# Altium project VCU_PIC32MK.PrjPcb
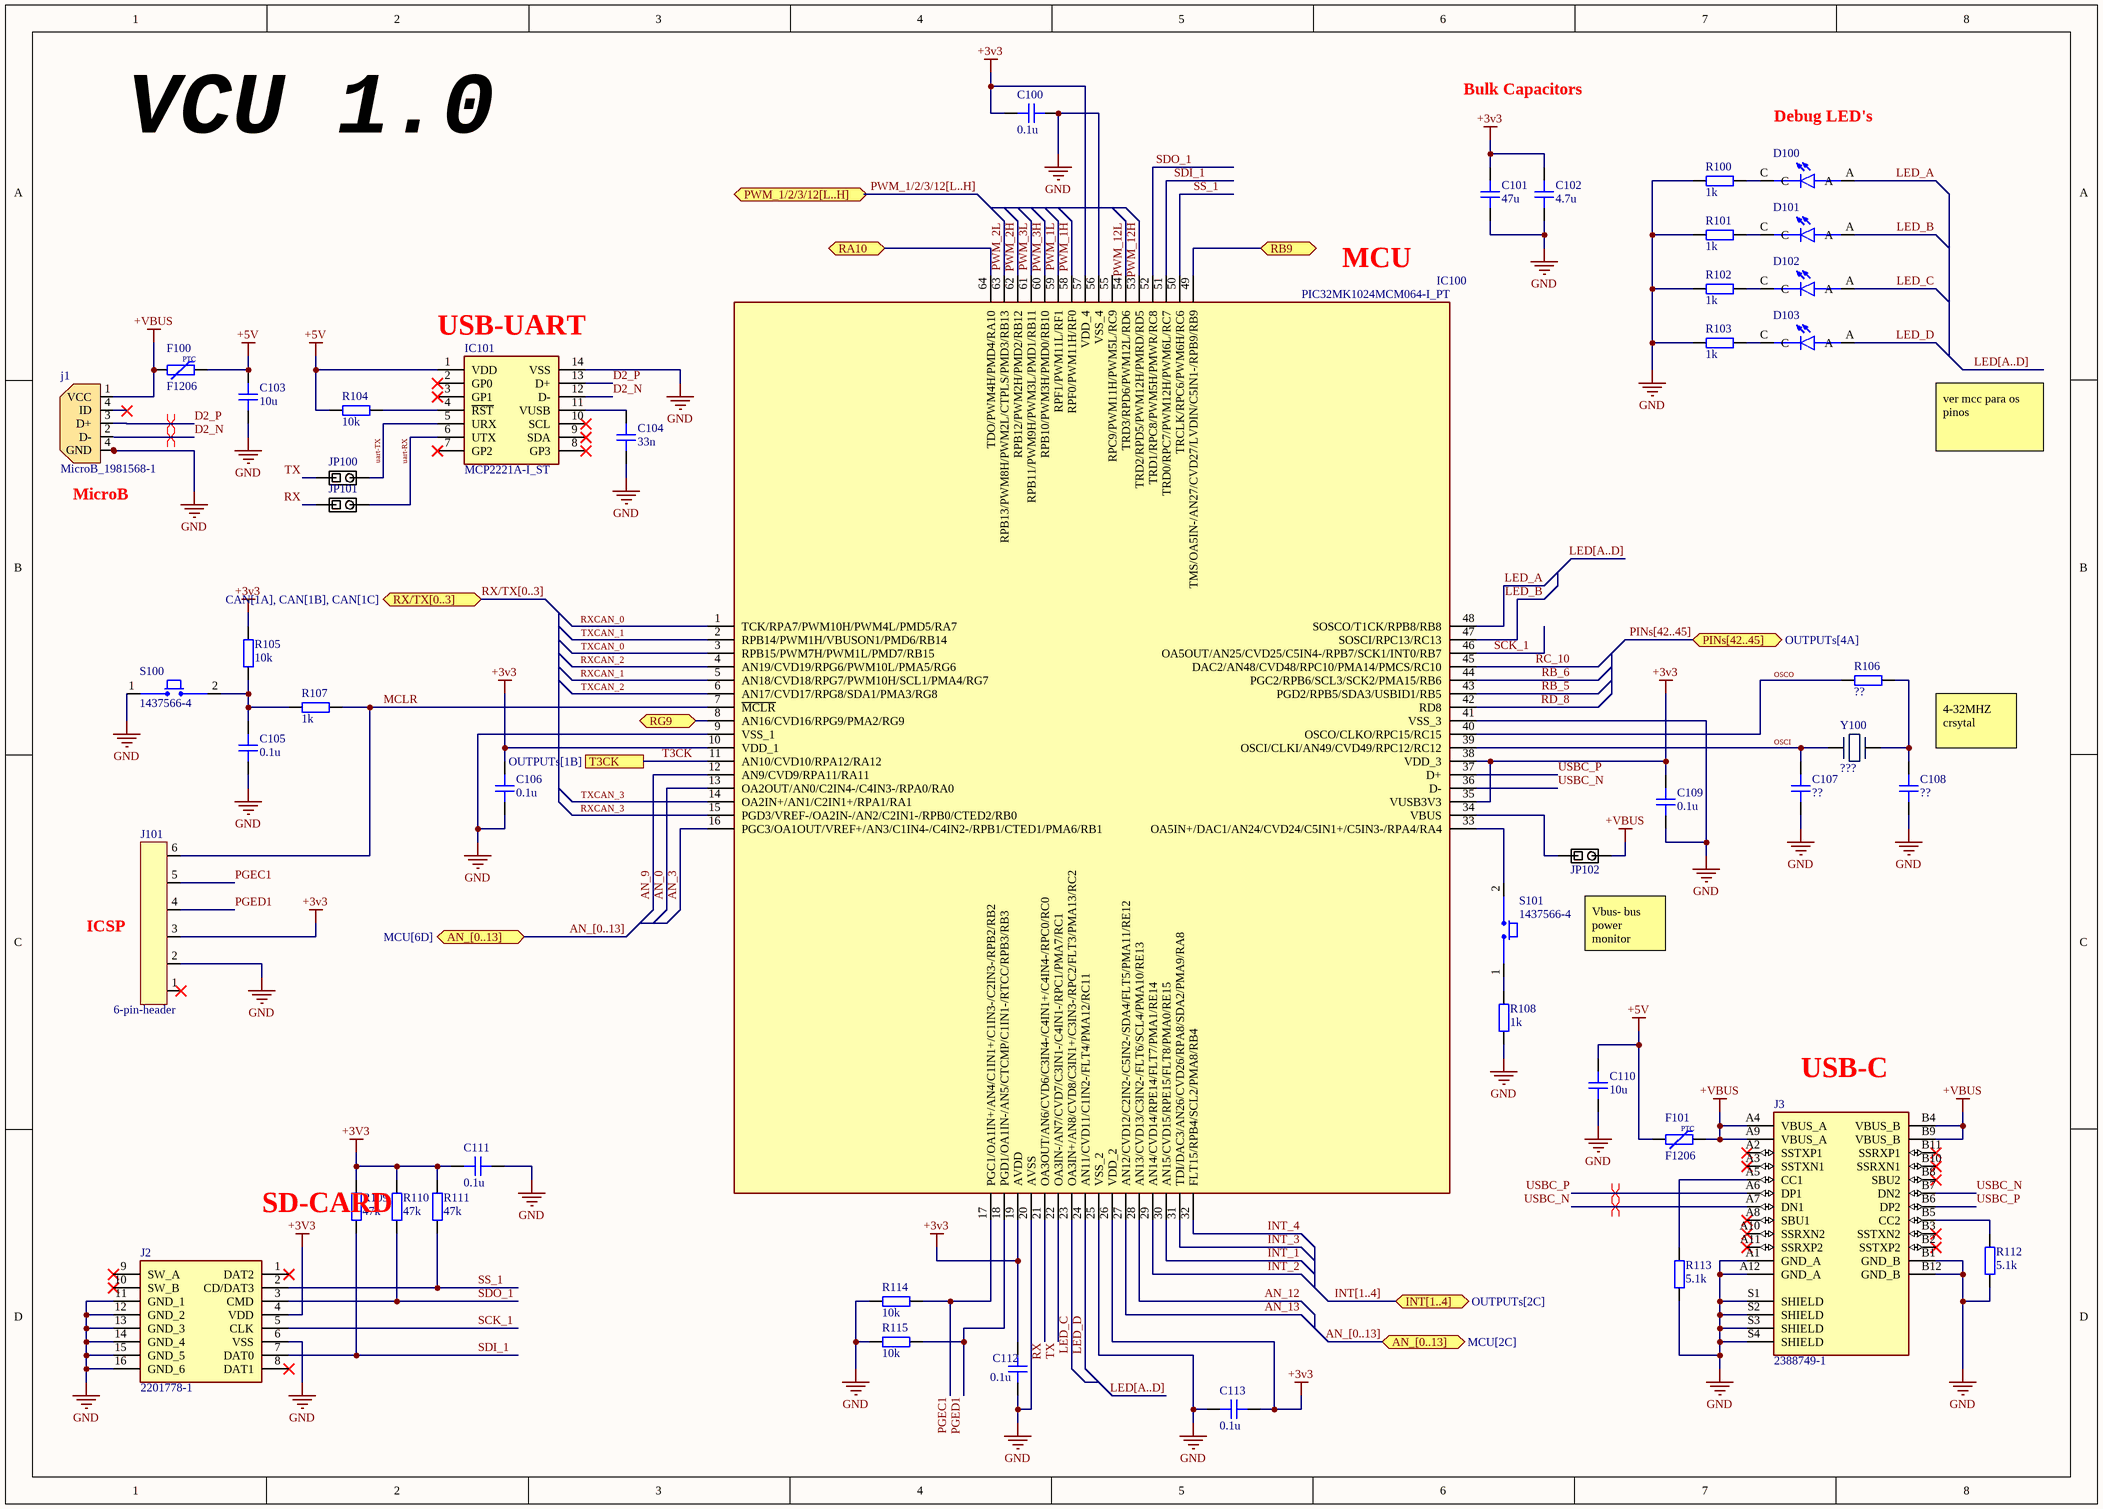
[diagram p0: MCU.SchDoc]
5 sheets, 135 parts. Net scope: global (net labels, ports and power ports of the same name join across sheets).
Board file: VCU_PCB.PcbDoc
Sheets:
  MCU.SchDoc
  POWER.SchDoc
  CAN.SchDoc
  OUTPUTs.SchDoc
  H_Bridge.SchDoc

## Sheet MCU.SchDoc
size A3; SheetNumber: 1; SheetTotal: 5

### Parts
C100  0.1u  [CAP_0805]
C101  47u  [CAP_0805]
C102  4.7u  [CAP_0805]
C103  10u  [CAP_0805]
C104  33n  [CAP_0805]
C105  0.1u  [CAP_0805]
C106  0.1u  [CAP_0805]
C107  ??  [CAP_0805]
C108  ??  [CAP_0805]
C109  0.1u  [CAP_0805]
C110  10u  [CAP_0805]
C111  0.1u  [CAP_0805]
C112  0.1u  [CAP_0805]
C113  0.1u  [CAP_0805]
D100  SML-LXT0805IW-TR  [LEDC2012X120N]  (value not drawn)
D101  SML-LXT0805IW-TR  [LEDC2012X120N]  (value not drawn)
D102  SML-LXT0805IW-TR  [LEDC2012X120N]  (value not drawn)
D103  SML-LXT0805IW-TR  [LEDC2012X120N]  (value not drawn)
F100  F1206  [FUSE_1206]
F101  F1206  [FUSE_1206]
IC100  PIC32MK1024MCM064-I_PT  [QFP50P1200X1200X120-64N]
IC101  MCP2221A-I_ST  [SOP65P640X120-14N]
j1  MicroB_1981568-1  [1981568-1]
J2  2201778-1  [22017781]
J3  2388749-1  [TE_2388749-1]
J101  6-pin-header  [G800W302018EU]
JP100  Solder Jumper  [SolderJumper_Single]  (value not drawn)
JP101  Solder Jumper  [SolderJumper_Single]  (value not drawn)
JP102  Solder Jumper  [SolderJumper_Single]  (value not drawn)
R100  1k  [RES_0805]
R101  1k  [RES_0805]
R102  1k  [RES_0805]
R103  1k  [RES_0805]
R104  10k  [RES_0805]
R105  10k  [RES_0805]
R106  ??  [RES_0805]
R107  1k  [RES_0805]
R108  1k  [RES_0805]
R109  47k  [RES_0805]
R110  47k  [RES_0805]
R111  47k  [RES_0805]
R112  5.1k  [RES_0805]
R113  5.1k  [RES_0805]
R114  10k  [RES_0805]
R115  10k  [RES_0805]
S100  1437566-4  [SW_1437566-4]
S101  1437566-4  [SW_1437566-4]
Y100  ???  [ABM38000MHZC4T]

### Ports
AN_[0..13] (bidir, see MCU[2C]), AN_[0..13] (bidir, see MCU[6D]), INT[1..4] (bidir, see OUTPUTs[2C]), PINs[42..45] (bidir, see OUTPUTs[4A]), PWM_1/2/3/12[L..H] (bidir), RA10 (bidir, see OUTPUTs[1C]), RB9 (bidir, see OUTPUTs[1C]), RG9 (bidir, see OUTPUTs[1C]), RX/TX[0..3] (bidir, see CAN[1A], CAN[1B], CAN[1C]), T3CK (see OUTPUTs[1B])

### Nets
+3v3: C100.1 C101.1 C102.1 C106.2 C109.1 C111.2 C112.2 C113.1 IC100.10(VDD_1) IC100.19(AVDD) IC100.26(VDD_2) IC100.35(VUSB3V3) IC100.38(VDD_3) IC100.57(VDD_4) J2.4(VDD) J101.3 R105.2 R109.2 R110.2 R111.2
+5V: C103.1 C110.1 F100.2 F101.1 IC101.1(VDD) R104.2
+VBUS: F100.1 F101.2 j1.1(VCC) J3.A4(VBUS_A) J3.A9(VBUS_A) J3.B4(VBUS_B) J3.B9(VBUS_B) JP102.2
GND: C100.2 C101.2 C102.2 C103.2 C104.1 C105.1 C106.1 C107.1 C108.1 C109.2 C110.2 C111.1 C112.1 C113.2 IC100.9(VSS_1) IC100.20(AVSS) IC100.25(VSS_2) IC100.41(VSS_3) IC100.56(VSS_4) IC101.14(VSS) j1.4(GND) J2.6(VSS) J2.11(GND_1) J2.12(GND_2) J2.13(GND_3) J2.14(GND_4) J2.15(GND_5) J2.16(GND_6) J3.A1(GND_A) J3.A12(GND_A) J3.B1(GND_B) J3.B12(GND_B) J3.S1(SHIELD) J3.S2(SHIELD) J3.S3(SHIELD) J3.S4(SHIELD) J101.2 R100.1 R101.1 R102.1 R103.1 R108.1 R112.2 R113.2 R114.2 R115.1 S100.1
AN_0: IC100.13(OA2OUT/AN0/C2IN4-/C4IN3-/RPA0/RA0)
AN_3: IC100.16(PGC3/OA1OUT/VREF+/AN3/C1IN4-/C4IN2-/RPB1/CTED1/PMA6/RB1)
AN_9: IC100.12(AN9/CVD9/RPA11/RA11)
AN_12: IC100.28(AN13/CVD13/C3IN2-/FLT6/SCL4/PMA10/RE13)
AN_13: IC100.27(AN12/CVD12/C2IN2-/C5IN2-/SDA4/FLT5/PMA11/RE12)
D2_N: IC101.12(D-) j1.2(D-)
D2_P: IC101.13(D+) j1.3(D+)
INT_1: IC100.30(AN15/CVD15/RPE15/FLT8/PMA0/RE15)
INT_2: IC100.29(AN14/CVD14/RPE14/FLT7/PMA1/RE14)
INT_3: IC100.31(TDI/DAC3/AN26/CVD26/RPA8/SDA2/PMA9/RA8)
INT_4: IC100.32(FLT15/RPB4/SCL2/PMA8/RB4)
LED_A: D100.A IC100.48(SOSCO/T1CK/RPB8/RB8)
LED_B: D101.A IC100.47(SOSCI/RPC13/RC13)
LED_C: D102.A IC100.23(OA3IN+/AN8/CVD8/C3IN1+/C3IN3-/RPC2/FLT3/PMA13/RC2)
LED_D: D103.A IC100.24(AN11/CVD11/C1IN2-/FLT4/PMA12/RC11)
MCLR: IC100.7(~{MCLR}) J101.6 R107.2
OSCI: C107.2 IC100.39(OSCI/CLKI/AN49/CVD49/RPC12/RC12) Y100.1
OSCO: IC100.40(OSCO/CLKO/RPC15/RC15) R106.2
PGEC1: IC100.17(PGC1/OA1IN+/AN4/C1IN1+/C1IN3-/C2IN3-/RPB2/RB2) J101.5 R114.1
PGED1: IC100.18(PGD1/OA1IN-/AN5/CTCMP/C1IN1-/RTCC/RPB3/RB3) J101.4 R115.2
PWM_1H: IC100.58(RPF0/PWM11H/RF0)
PWM_1L: IC100.59(RPF1/PWM11L/RF1)
PWM_2H: IC100.62(RPB12/PWM2H/PMD2/RB12)
PWM_2L: IC100.63(RPB13/PWM8H/PWM2L/CTPLS/PMD3/RB13)
PWM_3H: IC100.60(RPB10/PWM3H/PMD0/RB10)
PWM_3L: IC100.61(RPB11/PWM9H/PWM3L/PMD1/RB11)
PWM_12H: IC100.53(TRD2/RPD5/PWM12H/PMRD/RD5)
PWM_12L: IC100.54(TRD3/RPD6/PWM12L/RD6)
RB_5: IC100.43(PGD2/RPB5/SDA3/USBID1/RB5)
RB_6: IC100.44(PGC2/RPB6/SCL3/SCK2/PMA15/RB6)
RC_10: IC100.45(DAC2/AN48/CVD48/RPC10/PMA14/PMCS/RC10)
RD_8: IC100.42(RD8)
RX: IC100.21(OA3OUT/AN6/CVD6/C3IN4-/C4IN1+/C4IN4-/RPC0/RC0) JP101.1
RXCAN_0: IC100.1(TCK/RPA7/PWM10H/PWM4L/PMD5/RA7)
RXCAN_1: IC100.5(AN18/CVD18/RPG7/PWM10H/SCL1/PMA4/RG7)
RXCAN_2: IC100.4(AN19/CVD19/RPG6/PWM10L/PMA5/RG6)
RXCAN_3: IC100.15(PGD3/VREF-/OA2IN-/AN2/C2IN1-/RPB0/CTED2/RB0)
SCK_1: IC100.46(OA5OUT/AN25/CVD25/C5IN4-/RPB7/SCK1/INT0/RB7) J2.5(CLK)
SDI_1: IC100.51(TRD0/RPC7/PWM12H/PWM6L/RC7) J2.7(DAT0) R109.1
SDO_1: IC100.52(TRD1/RPC8/PWM5H/PMWR/RC8) J2.3(CMD) R110.1
SS_1: IC100.50(TRCLK/RPC6/PWM6H/RC6) J2.2(CD/DAT3) R111.1
T3CK: IC100.11(AN10/CVD10/RPA12/RA12) ; port T3CK
TX: IC100.22(OA3IN-/AN7/CVD7/C3IN1-/C4IN1-/RPC1/PMA7/RC1) JP100.1
TXCAN_0: IC100.3(RPB15/PWM7H/PWM1L/PMD7/RB15)
TXCAN_1: IC100.2(RPB14/PWM1H/VBUSON1/PMD6/RB14)
TXCAN_2: IC100.6(AN17/CVD17/RPG8/SDA1/PMA3/RG8)
TXCAN_3: IC100.14(OA2IN+/AN1/C2IN1+/RPA1/RA1)
uart-RX: IC101.6(UTX) JP101.2
uart-TX: IC101.5(URX) JP100.2
USBC_N: IC100.36(D-) J3.A7(DN1) J3.B7(DN2)
USBC_P: IC100.37(D+) J3.A6(DP1) J3.B6(DP2)
NetC104_2: C104.2 IC101.11(VUSB)
NetC105_2: C105.2 R105.1 R107.1 S100.2
NetC108_2: C108.2 R106.1 Y100.2
NetD100_C: D100.C R100.2
NetD101_C: D101.C R101.2
NetD102_C: D102.C R102.2
NetD103_C: D103.C R103.2
NetIC100_8: IC100.8(AN16/CVD16/RPG9/PMA2/RG9) ; port RG9
NetIC100_33: IC100.33(OA5IN+/DAC1/AN24/CVD24/C5IN1+/C5IN3-/RPA4/RA4) S101.2
NetIC100_34: IC100.34(VBUS) JP102.1
NetIC100_49: IC100.49(TMS/OA5IN-/AN27/CVD27/LVDIN/C5IN1-/RPB9/RB9) ; port RB9
NetIC100_64: IC100.64(TDO/PWM4H/PMD4/RA10) ; port RA10
NetIC101_4: IC101.4(~{RST}) R104.1
NetJ3_A5: J3.A5(CC1) R113.1
NetJ3_B5: J3.B5(CC2) R112.1
NetR108_2: R108.2 S101.1

Not connected (* = marked no-connect by the designer): IC100 55(RPC9/PWM11H/PWM5L/RC9); IC101 2(GP0)* 3(GP1)* 7(GP2)* 8(GP3)* 9(SDA)* 10(SCL)*; J2 1(DAT2)* 8(DAT1)* 9(SW_A)* 10(SW_B)*; J3 A2(SSTXP1)* A3(SSTXN1)* A8(SBU1)* A10(SSRXN2)* A11(SSRXP2)* B2(SSTXP2)* B3(SSTXN2)* B8(SBU2)* B10(SSRXN1)* B11(SSRXP1)*; J101 1*

### Buses and harness runs
bus AN_[0..13] = port AN_[0..13]
bus INT[1..4] = port INT[1..4]
bus LED[A..D]
bus PINs[42..45] = port PINs[42..45]
bus PWM_1/2/3/12[L..H] = port PWM_1/2/3/12[L..H]
bus RX/TX[0..3] = port RX/TX[0..3]

### Layout directives
differential pair; net class DIFF_USB: D2_N, D2_P
differential pair: USBC_N, USBC_P

### Notes on the sheet
- Bulk Capacitors
- VCU 1.0
- Debug LED's
- (near IC100) MCU
- (near IC101) USB-UART
- ver mcc para os pinos
- (near j1) MicroB
- 4-32MHZ crsytal
- (near J101) ICSP
- (near JP102) Vbus- bus power monitor
- (near J3) USB-C
- SD-CARD
- (in symbol FUSE_PPTC_1206) PTC

### Library data of the parts
C100-C102 C105-C109 C112 C113 = CAP_0805_16V: Capacitor SMD 0805 16V
C103 C104 C110 C111 = CAP_0805_10V: Capacitor SMD 0805 10V
D100-D103 = SML-LXT0805IW-TR: Red - LED Indication - Discrete 2V 0805 (2012 Metric); MF: Lumex Opto/Components; Check_prices: https://www.snapeda.com/parts/SML-LXT0805IW-TR/Lumex+Opto%252FComponents+Inc./view-part/?ref=eda; Price: None; MP: SML-LXT0805IW-TR; SnapEDA_Link: https://www.snapeda.com/parts/SML-LXT0805IW-TR/Lumex+Opto%252FComponents+Inc./view-part/?ref=snap; Availability: In Stock; Value: *; Purchase-URL: https://pricing.snapeda.com/search/part/SML-LXT0805IW-TR/?ref=eda; Package: 0805 Lumex
F100 F101 = FUSE_PPTC_1206: Fuse PPTC SMD 1206; Manufacturer: *; Manufacturer Part Number: *
IC100 = PIC32MK1024MCM064-I_PT: Integrated Circuit; Manufacturer_Name: Microchip; Manufacturer_Part_Number: PIC32MK1024MCM064-I/PT; Datasheet Link: https://ww1.microchip.com/downloads/aemDocuments/documents/MCU32/ProductDocuments/DataSheets/PIC32MK-GPK-MCM-with-CAN-FD-Family-DataSheet-DS60001519E.pdf; Height: 1.2mm; Mouser Part Number: 579-2MK1024MCM064IPT; Mouser Price/Stock: https://www.mouser.co.uk/ProductDetail/Microchip-Technology/PIC32MK1024MCM064-I-PT?qs=W%2FMpXkg%252BdQ4dBI32NJdQMg%3D%3D; Arrow Part Number: PIC32MK1024MCM064-I/PT; Arrow Price/Stock: https://www.arrow.com/en/products/pic32mk1024mcm064-ipt/microchip-technology?region=nac
IC101 = MCP2221A-I_ST: Integrated Circuit; Manufacturer_Name: Microchip; Manufacturer_Part_Number: MCP2221A-I/ST; Datasheet Link: http://ww1.microchip.com/downloads/en/devicedoc/20005565b.pdf; Height: 1.2mm; Mouser Part Number: 579-MCP2221A-I/ST; Mouser Price/Stock: https://www.mouser.co.uk/ProductDetail/Microchip-Technology-Atmel/MCP2221A-I-ST?qs=ZEMkBHnybREMkqMgzOrcGQ%3D%3D; Arrow Part Number: MCP2221A-I/ST; Arrow Price/Stock: https://www.arrow.com/en/products/mcp2221a-ist/microchip-technology?region=nac
j1 = Micro_B
J2 = 2201778-1: Connector; Manufacturer_Name: TE Connectivity; Datasheet Link: https://www.te.com/commerce/DocumentDelivery/DDEController?Action=showdoc&DocId=Customer+Drawing%7F2201778%7FB%7Fpdf%7FJapanese%7FJPN_CD_2201778_B.pdf%7F2201778-1; Height: 1.95mm; Manufacturer_Part_Number: 2201778-1; Mouser Part Number: 571-2201778-1; Mouser Price/Stock: https://www.mouser.co.uk/ProductDetail/TE-Connectivity/2201778-1?qs=%2F6W%2F9%2FHWvcBMWWw9w8oBng%3D%3D; Arrow Part Number: 2201778-1; Arrow Price/Stock: https://www.arrow.com/en/products/2201778-1/te-connectivity?region=nac
J3 = 2388749-1: USB-C (USB TYPE-C) USB 4.0 Receptacle Connector 24 Position Surface Mount, Right Angle; Through Hole; MF: TE Connectivity; Value: *; SnapEDA_Link: https://www.snapeda.com/parts/2388749-1/TE+Connectivity/view-part/?ref=snap; Purchase-URL: https://pricing.snapeda.com/search/part/2388749-1/?ref=eda; Availability: In Stock; Price: None; Package: None; Check_prices: https://www.snapeda.com/parts/2388749-1/TE+Connectivity/view-part/?ref=eda; MP: 2388749-1
J101 = G800W302018EU: Pin Header 6 Position 2.54mm Pitch; Manufacturer: Amphenol; Manufacturer Part Number: G800W302018EU
JP100-JP102 = SolderJumper_Single: Solder Jumper Single 0.5mm Pitch
R100-R115 = RES_0805: Resistor SMD 0805
S100 S101 = 1437566-4: Tactile Switch SPST-NO Top Actuated Surface Mount; MF: TE Connectivity; Check_prices: https://www.snapeda.com/parts/1437566-4/TE+Connectivity+ALCOSWITCH+Switches/view-part/?ref=eda; Package: None; MP: 1437566-4; Value: *; SnapEDA_Link: https://www.snapeda.com/parts/1437566-4/TE+Connectivity+ALCOSWITCH+Switches/view-part/?ref=snap
Y100 = Crystal_SMD

## Sheet POWER.SchDoc
size A4; SheetNumber: 2; SheetTotal: 5
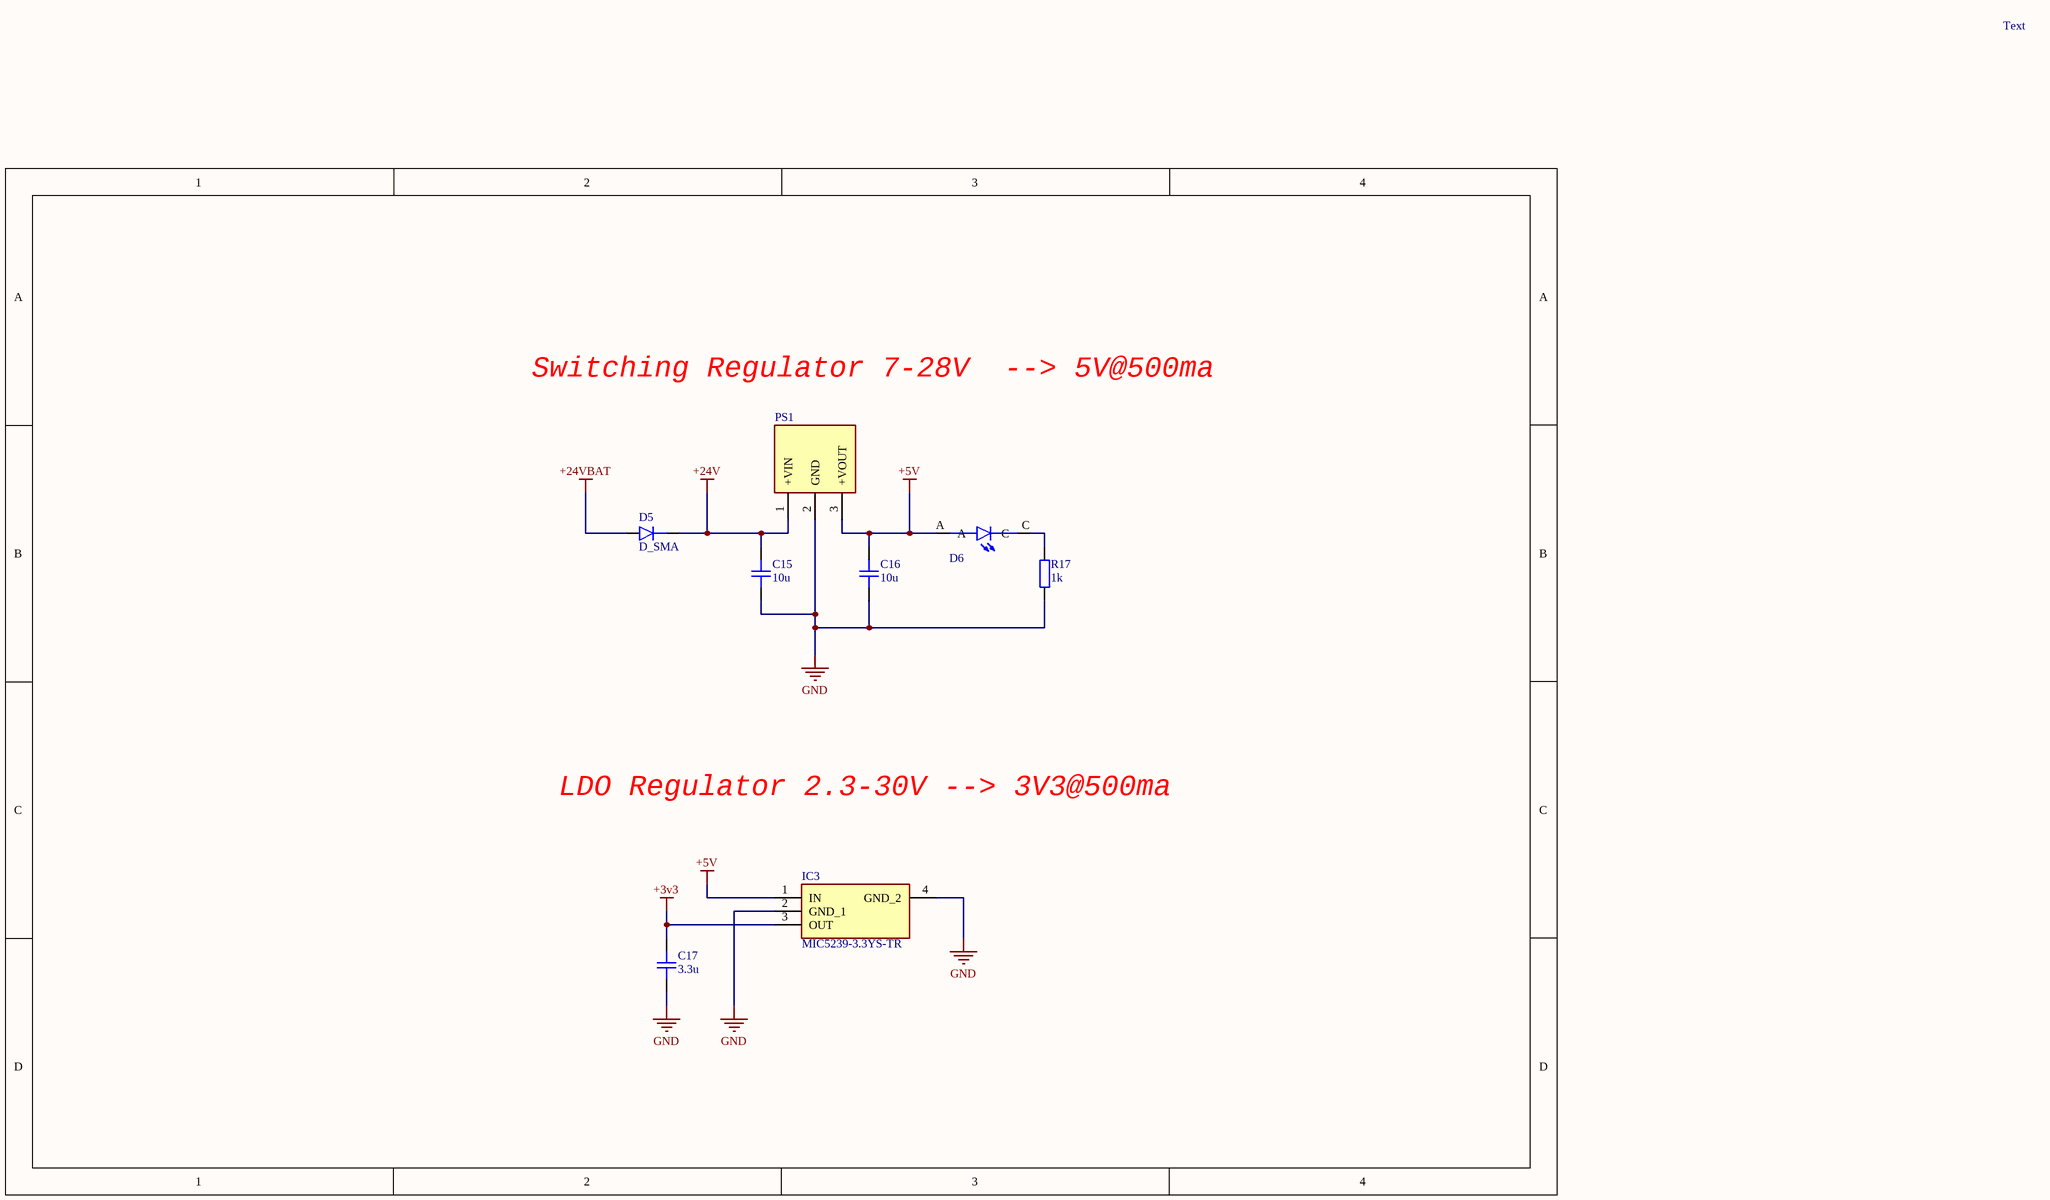
[diagram p1: POWER.SchDoc]

### Parts
C15  10u  [CAP_0805]
C16  10u  [CAP_0805]
C17  3.3u  [CAP_0805]
D5  D_SMA  [DO-214AC-2 (SMA)]
D6  SML-LXT0805IW-TR  [LEDC2012X120N]  (value not drawn)
IC3  MIC5239-3.3YS-TR  [SOT230P700X180-4N]
PS1  R-78E5.0-0.5  [R78E5005]  (value not drawn)
R17  1k  [RES_0805]

### Nets
+3v3: C17.2 IC3.3(OUT)
+5V: C16.2 D6.A IC3.1(IN) PS1.3(+VOUT)
+24V: C15.2 D5.K PS1.1(+VIN)
+24VBAT: D5.A
GND: C15.1 C16.1 C17.1 IC3.2(GND_1) IC3.4(GND_2) PS1.2(GND) R17.2
NetD6_C: D6.C R17.1

### Notes on the sheet
- Text
- Switching Regulator 7-28V  --> 5V@500ma
- LDO Regulator 2.3-30V --> 3V3@500ma

### Library data of the parts
C15-C17 = CAP_0805_10V: Capacitor SMD 0805 10V
D5 = D_SMA: Diode SMD SMA (DO-214AA)
D6 = SML-LXT0805IW-TR: as D100 on sheet MCU; Check_prices: https://www.snapeda.com/parts/SML-LXT0805IW-TR/Lumex+Opto%252FComponents+Inc./view-part/?ref=eda; Price: None; MP: SML-LXT0805IW-TR; SnapEDA_Link: https://www.snapeda.com/parts/SML-LXT0805IW-TR/Lumex+Opto%252FComponents+Inc./view-part/?ref=snap; Availability: In Stock; Value: *; Purchase-URL: https://pricing.snapeda.com/search/part/SML-LXT0805IW-TR/?ref=eda; Package: 0805 Lumex
IC3 = MIC5239-3.3YS-TR: Integrated Circuit; Manufacturer_Name: Microchip; Datasheet Link: https://ww1.microchip.com/downloads/en/DeviceDoc/mic5239.pdf; Height: 1.8mm; Manufacturer_Part_Number: MIC5239-3.3YS-TR; Mouser Part Number: 998-MIC5239-3.3YSTR; Mouser Price/Stock: https://www.mouser.co.uk/ProductDetail/Microchip-Technology-Micrel/MIC5239-33YS-TR?qs=U6T8BxXiZAXN0UitWWB92A%3D%3D; Arrow Part Number: MIC5239-3.3YS-TR; Arrow Price/Stock: https://www.arrow.com/en/products/mic5239-3.3ys-tr/microchip-technology?region=nac
PS1 = R-78E5.0-0.5: Power Supply; Manufacturer_Name: RECOM Power; Datasheet Link: https://datasheet.datasheetarchive.com/originals/distributors/Datasheets_SAMA/1560217c2d38d5ce10907af13420fc49.pdf; Height: 10.9mm; Manufacturer_Part_Number: R-78E5.0-0.5; Mouser Part Number: 919-R-78E5.0-0.5; Mouser Price/Stock: https://www.mouser.co.uk/ProductDetail/RECOM-Power/R-78E5.0-0.5?qs=JeAkOuORR2UvBuiB2kZVZQ%3D%3D; Arrow Part Number: R-78E5.0-0.5; Arrow Price/Stock: https://www.arrow.com/en/products/r-78e5.0-0.5/recom-power?region=europe
R17 = RES_0805: Resistor SMD 0805

## Sheet CAN.SchDoc
size A3; SheetNumber: 3; SheetTotal: 5
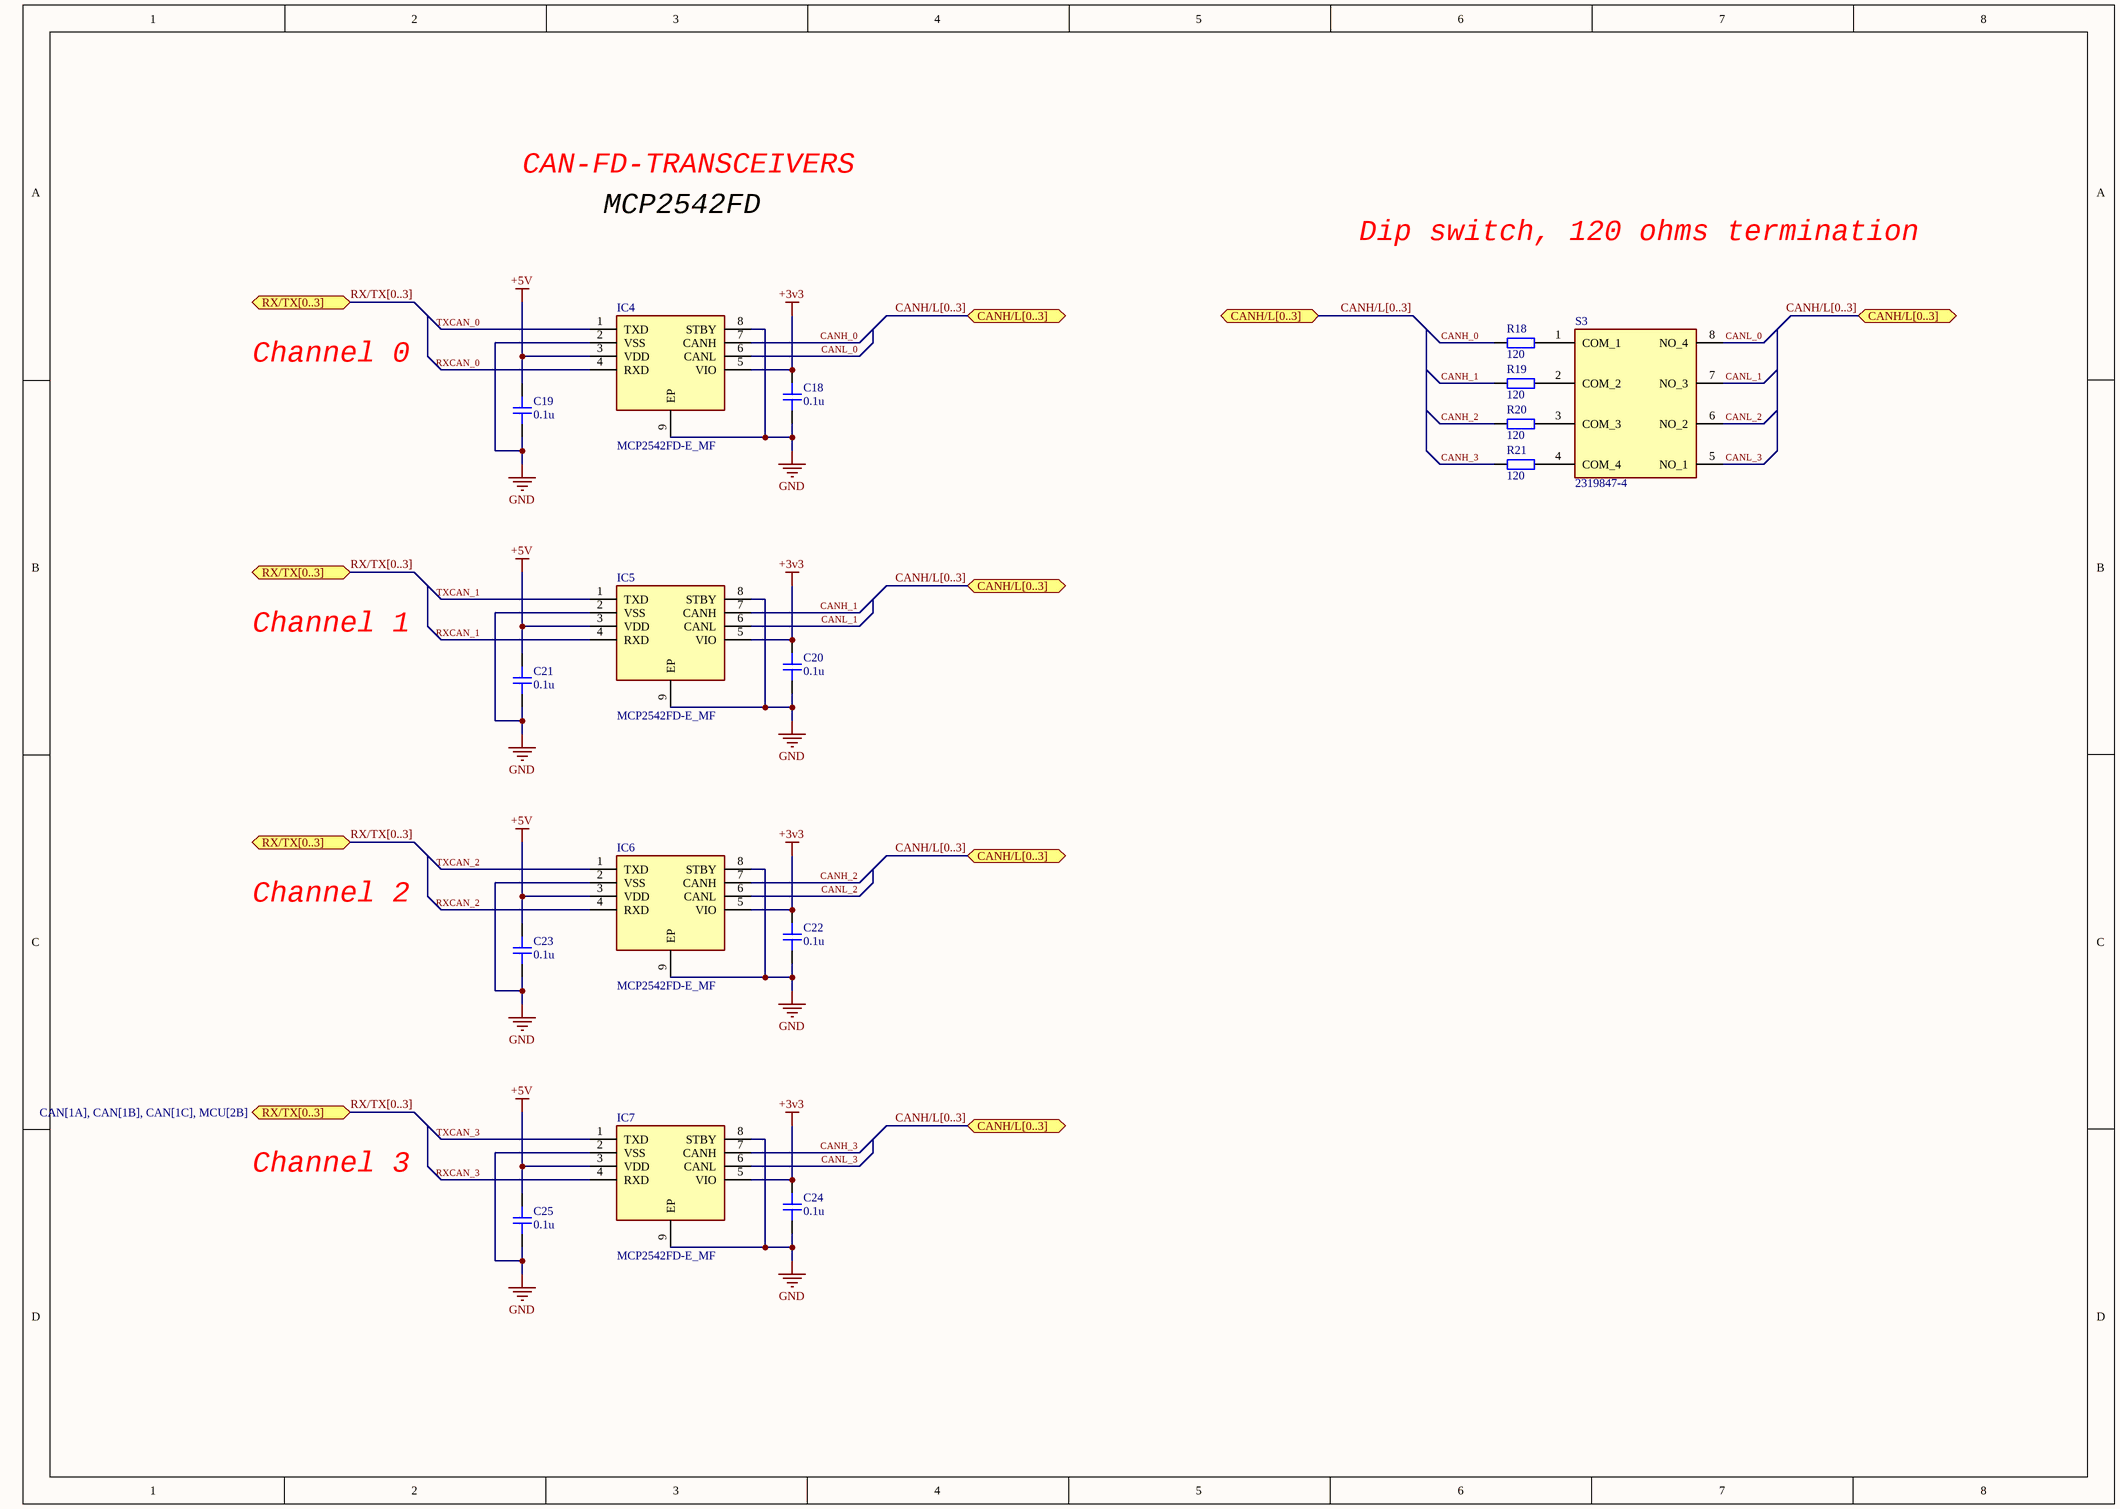
[diagram p2: CAN.SchDoc]

### Parts
C18  0.1u  [CAP_0805]
C19  0.1u  [CAP_0805]
C20  0.1u  [CAP_0805]
C21  0.1u  [CAP_0805]
C22  0.1u  [CAP_0805]
C23  0.1u  [CAP_0805]
C24  0.1u  [CAP_0805]
C25  0.1u  [CAP_0805]
IC4  MCP2542FD-E_MF  [SON65P300X300X100-9N-D]
IC5  MCP2542FD-E_MF  [SON65P300X300X100-9N-D]
IC6  MCP2542FD-E_MF  [SON65P300X300X100-9N-D]
IC7  MCP2542FD-E_MF  [SON65P300X300X100-9N-D]
R18  120  [RES_0805]
R19  120  [RES_0805]
R20  120  [RES_0805]
R21  120  [RES_0805]
S3  2319847-4  [23198474]

### Ports
CANH/L[0..3] (bidir, see CAN[4A], CAN[4B], CAN[4C], CAN[5A], CAN[8A], OUTPUTs[3B]), CANH/L[0..3] (bidir, see CAN[4A], CAN[4B], CAN[4C], CAN[5A], OUTPUTs[3B]), CANH/L[0..3] (bidir, see CAN[4A], CAN[4B], CAN[4C], CAN[8A], OUTPUTs[3B]), CANH/L[0..3] (bidir, see CAN[4A], CAN[4C], CAN[5A], CAN[8A], OUTPUTs[3B]), CANH/L[0..3] (bidir, see CAN[4B], CAN[4C], CAN[5A], CAN[8A], OUTPUTs[3B]), RX/TX[0..3] (bidir, see CAN[1A], CAN[1B], CAN[1C], MCU[2B]), RX/TX[0..3] (bidir, see CAN[1A], CAN[1C], MCU[2B]), RX/TX[0..3] (bidir, see CAN[1B], CAN[1C], MCU[2B])

### Nets
+3v3: C18.2 C20.2 C22.2 C24.2 IC4.5(VIO) IC5.5(VIO) IC6.5(VIO) IC7.5(VIO)
+5V: C19.2 C21.2 C23.2 C25.2 IC4.3(VDD) IC5.3(VDD) IC6.3(VDD) IC7.3(VDD)
GND: C18.1 C19.1 C20.1 C21.1 C22.1 C23.1 C24.1 C25.1 IC4.2(VSS) IC4.8(STBY) IC4.9(EP) IC5.2(VSS) IC5.8(STBY) IC5.9(EP) IC6.2(VSS) IC6.8(STBY) IC6.9(EP) IC7.2(VSS) IC7.8(STBY) IC7.9(EP)
CANH_0: IC4.7(CANH) R18.1
CANH_1: IC5.7(CANH) R19.1
CANH_2: IC6.7(CANH) R20.1
CANH_3: IC7.7(CANH) R21.1
CANL_0: IC4.6(CANL) S3.8(NO_4)
CANL_1: IC5.6(CANL) S3.7(NO_3)
CANL_2: IC6.6(CANL) S3.6(NO_2)
CANL_3: IC7.6(CANL) S3.5(NO_1)
RXCAN_0: IC4.4(RXD)
RXCAN_1: IC5.4(RXD)
RXCAN_2: IC6.4(RXD)
RXCAN_3: IC7.4(RXD)
TXCAN_0: IC4.1(TXD)
TXCAN_1: IC5.1(TXD)
TXCAN_2: IC6.1(TXD)
TXCAN_3: IC7.1(TXD)
NetR18_2: R18.2 S3.1(COM_1)
NetR19_2: R19.2 S3.2(COM_2)
NetR20_2: R20.2 S3.3(COM_3)
NetR21_2: R21.2 S3.4(COM_4)

### Buses and harness runs
bus CANH/L[0..3] = port CANH/L[0..3]
bus RX/TX[0..3] = port RX/TX[0..3]

### Notes on the sheet
- CAN-FD-TRANSCEIVERS
- MCP2542FD
- Dip switch, 120 ohms termination
- Channel 0
- Channel 1
- Channel 2
- Channel 3

### Library data of the parts
C18-C25 = CAP_0805_10V: Capacitor SMD 0805 10V
IC4-IC7 = MCP2542FD-E_MF: Integrated Circuit; Manufacturer_Name: Microchip; Manufacturer_Part_Number: MCP2542FD-E/MF; Datasheet Link: http://ww1.microchip.com/downloads/en/devicedoc/20005514a.pdf; Height: 1mm; Mouser Part Number: 579-MCP2542FD-E/MF; Mouser Price/Stock: https://www.mouser.co.uk/ProductDetail/Microchip-Technology-Atmel/MCP2542FD-E-MF?qs=l7cgNqFNU1jog4BwTzULBw%3D%3D; Arrow Part Number: MCP2542FD-E/MF; Arrow Price/Stock: https://www.arrow.com/en/products/mcp2542fd-emf/microchip-technology?region=nac
R18-R21 = RES_0805: Resistor SMD 0805
S3 = 2319847-4: Switch; Manufacturer_Name: TE Connectivity; Datasheet Link: https://www.te.com/commerce/DocumentDelivery/DDEController?Action=srchrtrv&DocNm=2319847&DocType=Customer+Drawing&DocLang=English&PartCntxt=2-2319847-4&DocFormat=pdf; Height: 3.7mm; Manufacturer_Part_Number: 2319847-4

## Sheet OUTPUTs.SchDoc
size A4; SheetNumber: 4; SheetTotal: 5
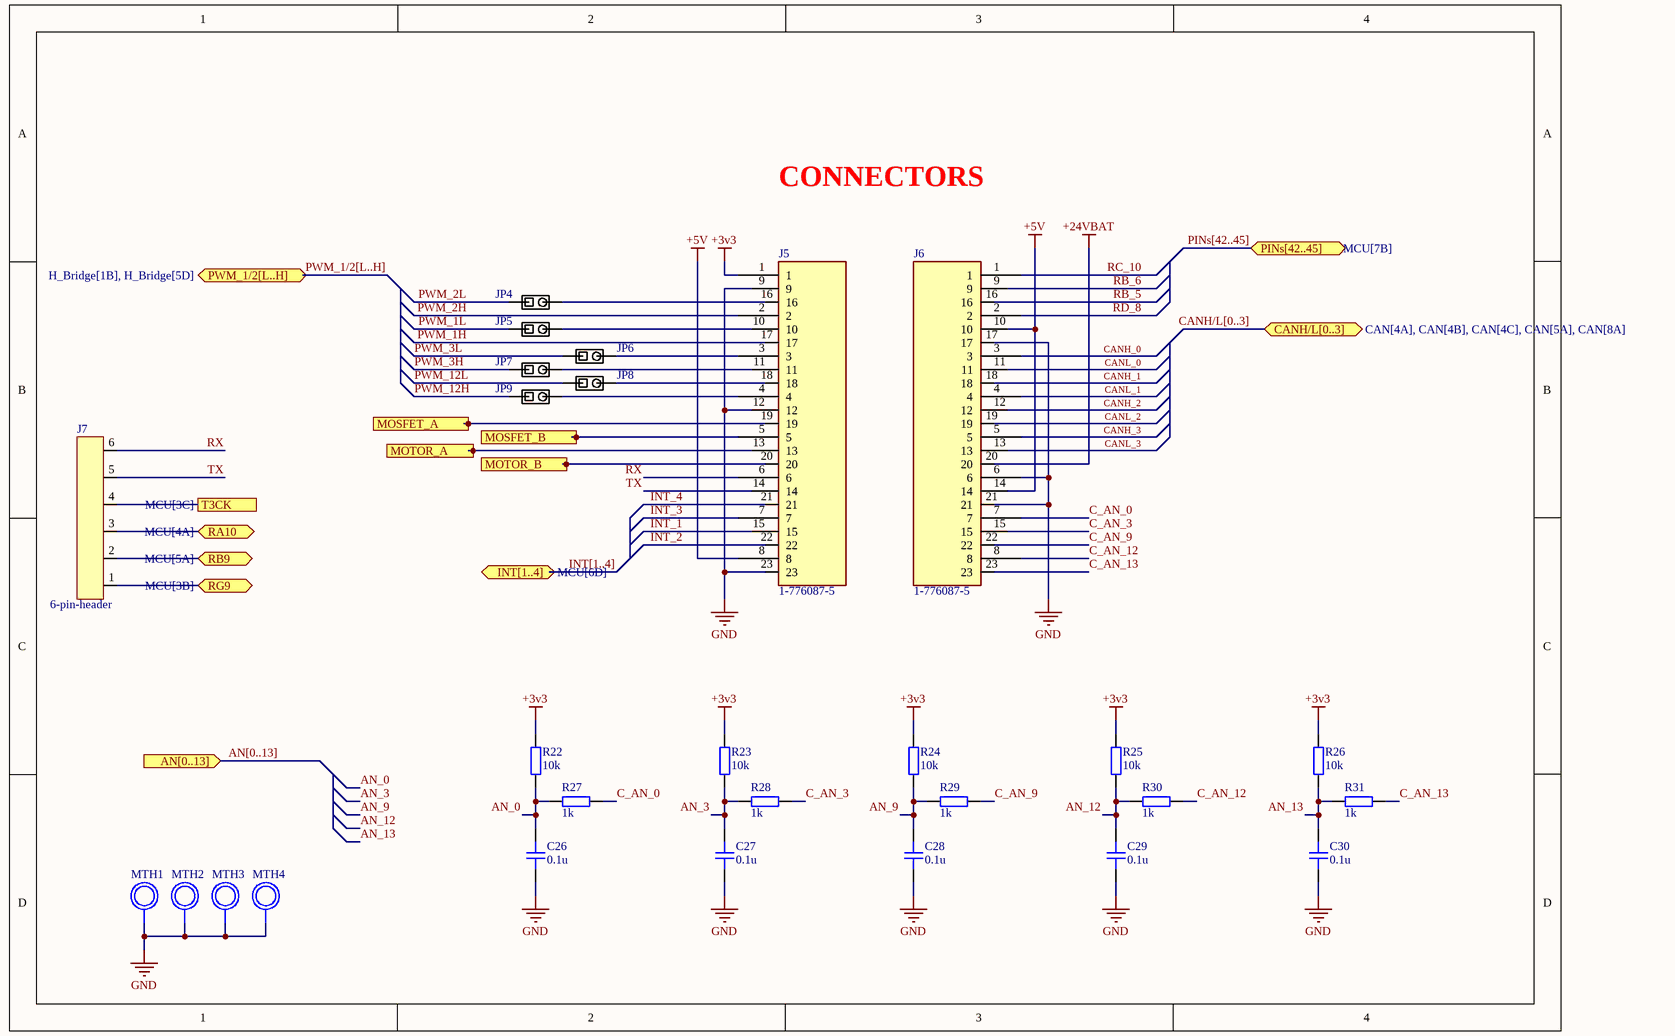
[diagram p3: OUTPUTs.SchDoc]

### Parts
C26  0.1u  [CAP_0805]
C27  0.1u  [CAP_0805]
C28  0.1u  [CAP_0805]
C29  0.1u  [CAP_0805]
C30  0.1u  [CAP_0805]
J5  1-776087-5  [TE_1-776087-5]
J6  1-776087-5  [TE_1-776087-5]
J7  6-pin-header  [G800W302018EU]
JP4  Solder Jumper  [SolderJumper_Single]  (value not drawn)
JP5  Solder Jumper  [SolderJumper_Single]  (value not drawn)
JP6  Solder Jumper  [SolderJumper_Single]  (value not drawn)
JP7  Solder Jumper  [SolderJumper_Single]  (value not drawn)
JP8  Solder Jumper  [SolderJumper_Single]  (value not drawn)
JP9  Solder Jumper  [SolderJumper_Single]  (value not drawn)
MTH1  Mounting_Hole_3.5mm  [Mounting_Hole_3.5mm]  (value not drawn)
MTH2  Mounting_Hole_3.5mm  [Mounting_Hole_3.5mm]  (value not drawn)
MTH3  Mounting_Hole_3.5mm  [Mounting_Hole_3.5mm]  (value not drawn)
MTH4  Mounting_Hole_3.5mm  [Mounting_Hole_3.5mm]  (value not drawn)
R22  10k  [RES_0805]
R23  10k  [RES_0805]
R24  10k  [RES_0805]
R25  10k  [RES_0805]
R26  10k  [RES_0805]
R27  1k  [RES_0805]
R28  1k  [RES_0805]
R29  1k  [RES_0805]
R30  1k  [RES_0805]
R31  1k  [RES_0805]

### Ports
AN[0..13] (in), CANH/L[0..3] (bidir, see CAN[4A], CAN[4B], CAN[4C], CAN[5A], CAN[8A]), INT[1..4] (bidir, see MCU[6D]), MOSFET_A (out, see H_Bridge[4B]), MOSFET_B (out, see H_Bridge[4D]), MOTOR_A (see H_Bridge[7C]), MOTOR_B (see H_Bridge[7C]), PINs[42..45] (bidir, see MCU[7B]), PWM_1/2[L..H] (bidir, see H_Bridge[1B], H_Bridge[5D]), RA10 (bidir, see MCU[4A]), RB9 (bidir, see MCU[5A]), RG9 (bidir, see MCU[3B]), T3CK (see MCU[3C])

### Nets
+3v3: J5.1 R22.2 R23.2 R24.2 R25.2 R26.2
+5V: J5.8 J6.10 J6.14
+24VBAT: J6.20
GND: C26.1 C27.1 C28.1 C29.1 C30.1 J5.9 J5.12 J5.23 J6.6 J6.17 J6.21 MTH1.1 MTH2.1 MTH3.1 MTH4.1
AN_0: C26.2 R22.1 R27.1
AN_3: C27.2 R23.1 R28.1
AN_9: C28.2 R24.1 R29.1
AN_12: C29.2 R25.1 R30.1
AN_13: C30.2 R26.1 R31.1
C_AN_0: J6.7 R27.2
C_AN_3: J6.15 R28.2
C_AN_9: J6.22 R29.2
C_AN_12: J6.8 R30.2
C_AN_13: J6.23 R31.2
CANH_0: J6.3
CANH_1: J6.18
CANH_2: J6.12
CANH_3: J6.5
CANL_0: J6.11
CANL_1: J6.4
CANL_2: J6.19
CANL_3: J6.13
INT_1: J5.15
INT_2: J5.22
INT_3: J5.7
INT_4: J5.21
MOSFET_A: J5.19 ; port MOSFET_A
MOSFET_B: J5.5 ; port MOSFET_B
PWM_1H: J5.17
PWM_1L: JP5.1
PWM_2H: J5.2
PWM_2L: JP4.1
PWM_3H: JP7.1
PWM_3L: JP6.1
PWM_12H: JP9.1
PWM_12L: JP8.1
RB_5: J6.16
RB_6: J6.9
RC_10: J6.1
RD_8: J6.2
RX: J5.6 J7.6
T3CK: J7.4 ; port T3CK
TX: J5.14 J7.5
NetC31_2: J5.13 ; port MOTOR_A
NetC35_2: J5.20 ; port MOTOR_B
NetIC100_8: J7.1 ; port RG9
NetIC100_49: J7.2 ; port RB9
NetIC100_64: J7.3 ; port RA10
NetJ5_3: J5.3 JP6.2
NetJ5_4: J5.4 JP9.2
NetJ5_10: J5.10 JP5.2
NetJ5_11: J5.11 JP7.2
NetJ5_16: J5.16 JP4.2
NetJ5_18: J5.18 JP8.2

### Buses and harness runs
bus AN[0..13] = port AN[0..13]
bus CANH/L[0..3] = port CANH/L[0..3]
bus INT[1..4] = port INT[1..4]
bus PINs[42..45] = port PINs[42..45]
bus PWM_1/2[L..H] = port PWM_1/2[L..H]

### Notes on the sheet
- CONNECTORS

### Library data of the parts
C26-C30 = CAP_0805_16V: Capacitor SMD 0805 16V
J5 J6 = 1-776087-5: CONN HDR 23POS R/A W/GASKET AU; MF: {'manufacturer': 'TE Connectivity'}; Package: None; Value: *; Availability: Unavailable; MP: 1-776087-5; Price: None
J7 = G800W302018EU: as J101 on sheet MCU; Manufacturer Part Number: G800W302018EU
JP4-JP9 = SolderJumper_Single: Solder Jumper Single 0.5mm Pitch
R22-R31 = RES_0805: Resistor SMD 0805

## Sheet H_Bridge.SchDoc
size A3; SheetNumber: 5; SheetTotal: 5
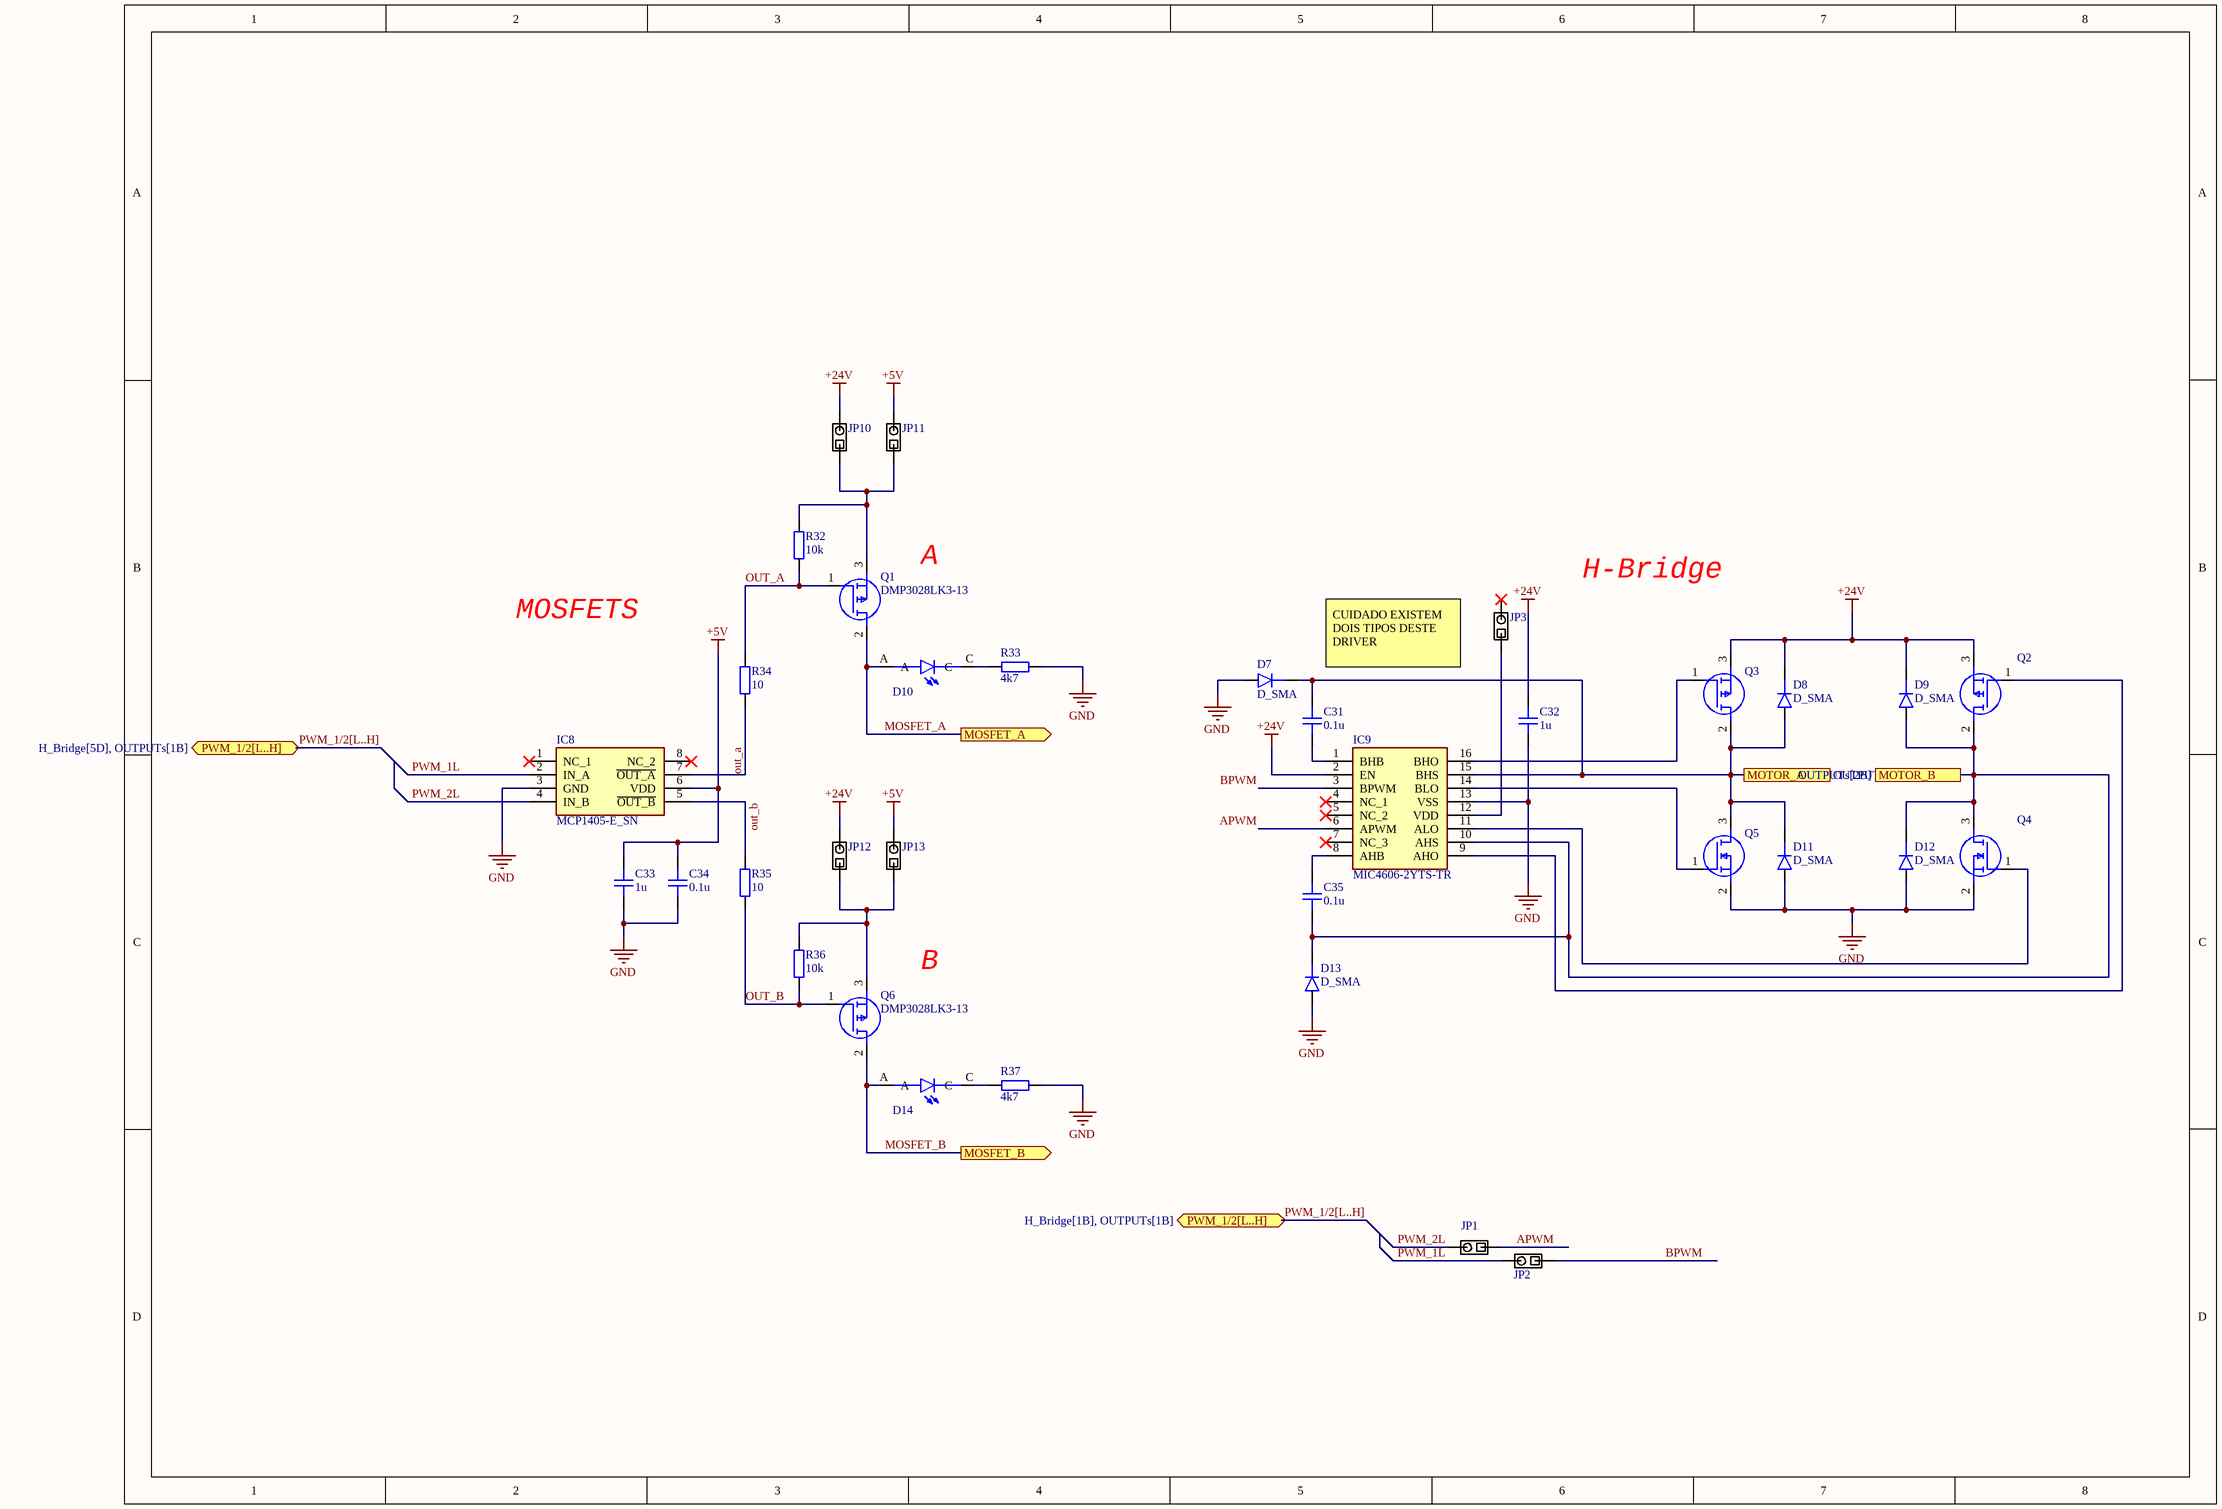
[diagram p4: H_Bridge.SchDoc]

### Parts
C31  0.1u  [CAP_0805]
C32  1u  [CAP_0805]
C33  1u  [CAP_0805]
C34  0.1u  [CAP_0805]
C35  0.1u  [CAP_0805]
D7  D_SMA  [DO-214AC-2 (SMA)]
D8  D_SMA  [DO-214AC-2 (SMA)]
D9  D_SMA  [DO-214AC-2 (SMA)]
D10  SML-LXT0805IW-TR  [LEDC2012X120N]  (value not drawn)
D11  D_SMA  [DO-214AC-2 (SMA)]
D12  D_SMA  [DO-214AC-2 (SMA)]
D13  D_SMA  [DO-214AC-2 (SMA)]
D14  SML-LXT0805IW-TR  [LEDC2012X120N]  (value not drawn)
IC8  MCP1405-E_SN  [SOIC127P600X175-8N]
IC9  MIC4606-2YTS-TR  [SOP65P640X120-16N]
JP1  Solder Jumper  [SolderJumper_Single]  (value not drawn)
JP2  Solder Jumper  [SolderJumper_Single]  (value not drawn)
JP3  Solder Jumper  [SolderJumper_Single]  (value not drawn)
JP10  Solder Jumper  [SolderJumper_Single]  (value not drawn)
JP11  Solder Jumper  [SolderJumper_Single]  (value not drawn)
JP12  Solder Jumper  [SolderJumper_Single]  (value not drawn)
JP13  Solder Jumper  [SolderJumper_Single]  (value not drawn)
Q1  DMP3028LK3-13  [DMP3028LK313]
Q2  DMP3028LK3-13  [DMP3028LK313]  (value not drawn)
Q3  DMP3028LK3-13  [DMP3028LK313]  (value not drawn)
Q4  NVD5C478NT4G  [DPAK_(SINGLE-GAUGE)_TO-252(369C)_ISSUE_F]  (value not drawn)
Q5  NVD5C478NT4G  [DPAK_(SINGLE-GAUGE)_TO-252(369C)_ISSUE_F]  (value not drawn)
Q6  DMP3028LK3-13  [DMP3028LK313]
R32  10k  [RES_0805]
R33  4k7  [RES_0805]
R34  10  [RES_0805]
R35  10  [RES_0805]
R36  10k  [RES_0805]
R37  4k7  [RES_0805]

### Ports
MOSFET_A (out, see OUTPUTs[1B]), MOSFET_B (out, see OUTPUTs[2B]), MOTOR_A (see OUTPUTs[1B]), MOTOR_B (see OUTPUTs[2B]), PWM_1/2[L..H] (bidir, see H_Bridge[1B], OUTPUTs[1B]), PWM_1/2[L..H] (bidir, see H_Bridge[5D], OUTPUTs[1B])

### Nets
+5V: C33.2 C34.2 IC8.6(VDD) JP11.2 JP13.2
+24V: C32.1 D8.K D9.K IC9.2(EN) JP10.2 JP12.2 Q2.3(S) Q3.3(S)
GND: C32.2 C33.1 C34.1 D7.A D11.A D12.A D13.A IC8.3(GND) IC9.13(VSS) Q4.2(S) Q5.2(S) R33.1 R37.1
APWM: IC9.6(APWM) JP1.1
BPWM: IC9.3(BPWM) JP2.1
MOSFET_A: D10.A Q1.2(D) ; port MOSFET_A
MOSFET_B: D14.A Q6.2(D) ; port MOSFET_B
OUT_A: IC8.7(~{OUT_A}) Q1.1(G) R32.1 R34.1 R34.2
OUT_B: IC8.5(~{OUT_B}) Q6.1(G) R35.1 R35.2 R36.1
PWM_1L: IC8.2(IN_A) JP2.2
PWM_2L: IC8.4(IN_B) JP1.2
NetC31_1: C31.1 IC9.1(BHB)
NetC31_2: C31.2 D7.K D8.A D11.K IC9.15(BHS) Q3.2(D) Q5.3(D) ; port MOTOR_A
NetC35_1: C35.1 IC9.8(AHB)
NetC35_2: C35.2 D9.A D12.K D13.K IC9.10(AHS) Q2.2(D) Q4.3(D) ; port MOTOR_B
NetD10_C: D10.C R33.2
NetD14_C: D14.C R37.2
NetIC9_9: IC9.9(AHO) Q2.1(G)
NetIC9_11: IC9.11(ALO) Q4.1(G)
NetIC9_12: IC9.12(VDD) JP3.1
NetIC9_14: IC9.14(BLO) Q5.1(G)
NetIC9_16: IC9.16(BHO) Q3.1(G)
NetJP10_1: JP10.1 JP11.1 Q1.3(S) R32.2
NetJP12_1: JP12.1 JP13.1 Q6.3(S) R36.2

Not connected (* = marked no-connect by the designer): IC8 1(NC_1)* 8(NC_2)*; IC9 4(NC_1)* 5(NC_2)* 7(NC_3)*; JP3 2*

### Buses and harness runs
bus PWM_1/2[L..H] = port PWM_1/2[L..H]

### Notes on the sheet
- A
- H-Bridge
- MOSFETS
- CUIDADO EXISTEM DOIS TIPOS DESTE DRIVER
- B

### Library data of the parts
C31-C35 = CAP_0805_10V: Capacitor SMD 0805 10V
D7-D9 D11-D13 = D_SMA: Diode SMD SMA (DO-214AA)
D10 D14 = SML-LXT0805IW-TR: as D100 on sheet MCU; Check_prices: https://www.snapeda.com/parts/SML-LXT0805IW-TR/Lumex+Opto%252FComponents+Inc./view-part/?ref=eda; Price: None; MP: SML-LXT0805IW-TR; SnapEDA_Link: https://www.snapeda.com/parts/SML-LXT0805IW-TR/Lumex+Opto%252FComponents+Inc./view-part/?ref=snap; Availability: In Stock; Value: *; Purchase-URL: https://pricing.snapeda.com/search/part/SML-LXT0805IW-TR/?ref=eda; Package: 0805 Lumex
IC8 = MCP1405-E_SN: Integrated Circuit; Manufacturer_Name: Microchip; Manufacturer_Part_Number: MCP1405-E/SN; Datasheet Link: https://datasheet.datasheetarchive.com/originals/distributors/SFDatasheet-4/sf-00090019.pdf; Height: 1.75mm; Mouser Part Number: 579-MCP1405-E/SN; Mouser Price/Stock: https://www.mouser.co.uk/ProductDetail/Microchip-Technology/MCP1405-E-SN?qs=usxtMOJb1Rz6iJkGGONxgg%3D%3D; Arrow Part Number: MCP1405-E/SN; Arrow Price/Stock: https://www.arrow.com/en/products/mcp1405-esn/microchip-technology
IC9 = MIC4606-2YTS-TR: Integrated Circuit; Manufacturer_Name: Microchip; Datasheet Link: https://eu.mouser.com/datasheet/2/268/20005604B-1286645.pdf; Height: 1.2mm; Manufacturer_Part_Number: MIC4606-2YTS-TR; Mouser Part Number: 579-MIC4606-2YTS-TR; Mouser Price/Stock: https://www.mouser.co.uk/ProductDetail/Microchip-Technology-Atmel/MIC4606-2YTS-TR?qs=fxR7EJxuiMGiGNq6G0IdXQ%3D%3D; Arrow Part Number: MIC4606-2YTS-TR; Arrow Price/Stock: https://www.arrow.com/en/products/mic4606-2yts-tr/microchip-technology?region=nac
JP1-JP3 JP10-JP13 = SolderJumper_Single: Solder Jumper Single 0.5mm Pitch
Q1-Q3 Q6 = DMP3028LK3-13: MOSFET (P-Channel); Manufacturer_Name: Diodes Inc.; Datasheet Link: https://componentsearchengine.com/Datasheets/1/DMP3028LK3-13.pdf; Height: 2.39mm; Manufacturer_Part_Number: DMP3028LK3-13; Mouser Part Number: 621-DMP3028LK3-13; Mouser Price/Stock: https://www.mouser.co.uk/ProductDetail/Diodes-Incorporated/DMP3028LK3-13?qs=OVC8WVYZliSFpRP3sPErZQ%3D%3D; Arrow Part Number: DMP3028LK3-13; Arrow Price/Stock: https://www.arrow.com/en/products/dmp3028lk3-13/diodes-incorporated
Q4 Q5 = NVD5C478NT4G: MOSFET (N-Channel); Manufacturer_Name: onsemi; Datasheet Link: http://www.onsemi.com/pub/Collateral/NVD5C478N-D.PDF; Manufacturer_Part_Number: NVD5C478NT4G; Mouser Part Number: 863-NVD5C478NT4G; Mouser Price/Stock: https://www.mouser.co.uk/ProductDetail/ON-Semiconductor/NVD5C478NT4G/?qs=y6ZabgHbY%252Bxvq0EyOcHTlg%3D%3D; Arrow Part Number: NVD5C478NT4G; Arrow Price/Stock: https://www.arrow.com/en/products/nvd5c478nt4g/on-semiconductor?region=nac
R32-R37 = RES_0805: Resistor SMD 0805

## Nets that join several sheets
+3v3: MCU (20 pins), POWER (C17.2 IC3.3), CAN (8 pins), OUTPUTs (6 pins)
+5V: MCU (6 pins), POWER (C16.2 D6.A IC3.1 PS1.3), CAN (8 pins), OUTPUTs (J5.8 J6.10 J6.14), H_Bridge (5 pins)
+24V: POWER (C15.2 D5.K PS1.1), H_Bridge (8 pins)
+24VBAT: POWER (D5.A), OUTPUTs (J6.20)
GND: MCU (47 pins), POWER (7 pins), CAN (20 pins), OUTPUTs (15 pins), H_Bridge (13 pins)
AN_0: MCU (IC100.13), OUTPUTs (C26.2 R22.1 R27.1)
AN_3: MCU (IC100.16), OUTPUTs (C27.2 R23.1 R28.1)
AN_9: MCU (IC100.12), OUTPUTs (C28.2 R24.1 R29.1)
AN_12: MCU (IC100.28), OUTPUTs (C29.2 R25.1 R30.1)
AN_13: MCU (IC100.27), OUTPUTs (C30.2 R26.1 R31.1)
CANH_0: CAN (IC4.7 R18.1), OUTPUTs (J6.3)
CANH_1: CAN (IC5.7 R19.1), OUTPUTs (J6.18)
CANH_2: CAN (IC6.7 R20.1), OUTPUTs (J6.12)
CANH_3: CAN (IC7.7 R21.1), OUTPUTs (J6.5)
CANL_0: CAN (IC4.6 S3.8), OUTPUTs (J6.11)
CANL_1: CAN (IC5.6 S3.7), OUTPUTs (J6.4)
CANL_2: CAN (IC6.6 S3.6), OUTPUTs (J6.19)
CANL_3: CAN (IC7.6 S3.5), OUTPUTs (J6.13)
INT_1: MCU (IC100.30), OUTPUTs (J5.15)
INT_2: MCU (IC100.29), OUTPUTs (J5.22)
INT_3: MCU (IC100.31), OUTPUTs (J5.7)
INT_4: MCU (IC100.32), OUTPUTs (J5.21)
MOSFET_A: OUTPUTs (J5.19), H_Bridge (D10.A Q1.2)
MOSFET_B: OUTPUTs (J5.5), H_Bridge (D14.A Q6.2)
NetC31_2: OUTPUTs (J5.13), H_Bridge (7 pins)
NetC35_2: OUTPUTs (J5.20), H_Bridge (7 pins)
NetIC100_8: MCU (IC100.8), OUTPUTs (J7.1)
NetIC100_49: MCU (IC100.49), OUTPUTs (J7.2)
NetIC100_64: MCU (IC100.64), OUTPUTs (J7.3)
PWM_1H: MCU (IC100.58), OUTPUTs (J5.17)
PWM_1L: MCU (IC100.59), OUTPUTs (JP5.1), H_Bridge (IC8.2 JP2.2)
PWM_2H: MCU (IC100.62), OUTPUTs (J5.2)
PWM_2L: MCU (IC100.63), OUTPUTs (JP4.1), H_Bridge (IC8.4 JP1.2)
PWM_3H: MCU (IC100.60), OUTPUTs (JP7.1)
PWM_3L: MCU (IC100.61), OUTPUTs (JP6.1)
PWM_12H: MCU (IC100.53), OUTPUTs (JP9.1)
PWM_12L: MCU (IC100.54), OUTPUTs (JP8.1)
RB_5: MCU (IC100.43), OUTPUTs (J6.16)
RB_6: MCU (IC100.44), OUTPUTs (J6.9)
RC_10: MCU (IC100.45), OUTPUTs (J6.1)
RD_8: MCU (IC100.42), OUTPUTs (J6.2)
RX: MCU (IC100.21 JP101.1), OUTPUTs (J5.6 J7.6)
RXCAN_0: MCU (IC100.1), CAN (IC4.4)
RXCAN_1: MCU (IC100.5), CAN (IC5.4)
RXCAN_2: MCU (IC100.4), CAN (IC6.4)
RXCAN_3: MCU (IC100.15), CAN (IC7.4)
T3CK: MCU (IC100.11), OUTPUTs (J7.4)
TX: MCU (IC100.22 JP100.1), OUTPUTs (J5.14 J7.5)
TXCAN_0: MCU (IC100.3), CAN (IC4.1)
TXCAN_1: MCU (IC100.2), CAN (IC5.1)
TXCAN_2: MCU (IC100.6), CAN (IC6.1)
TXCAN_3: MCU (IC100.14), CAN (IC7.1)